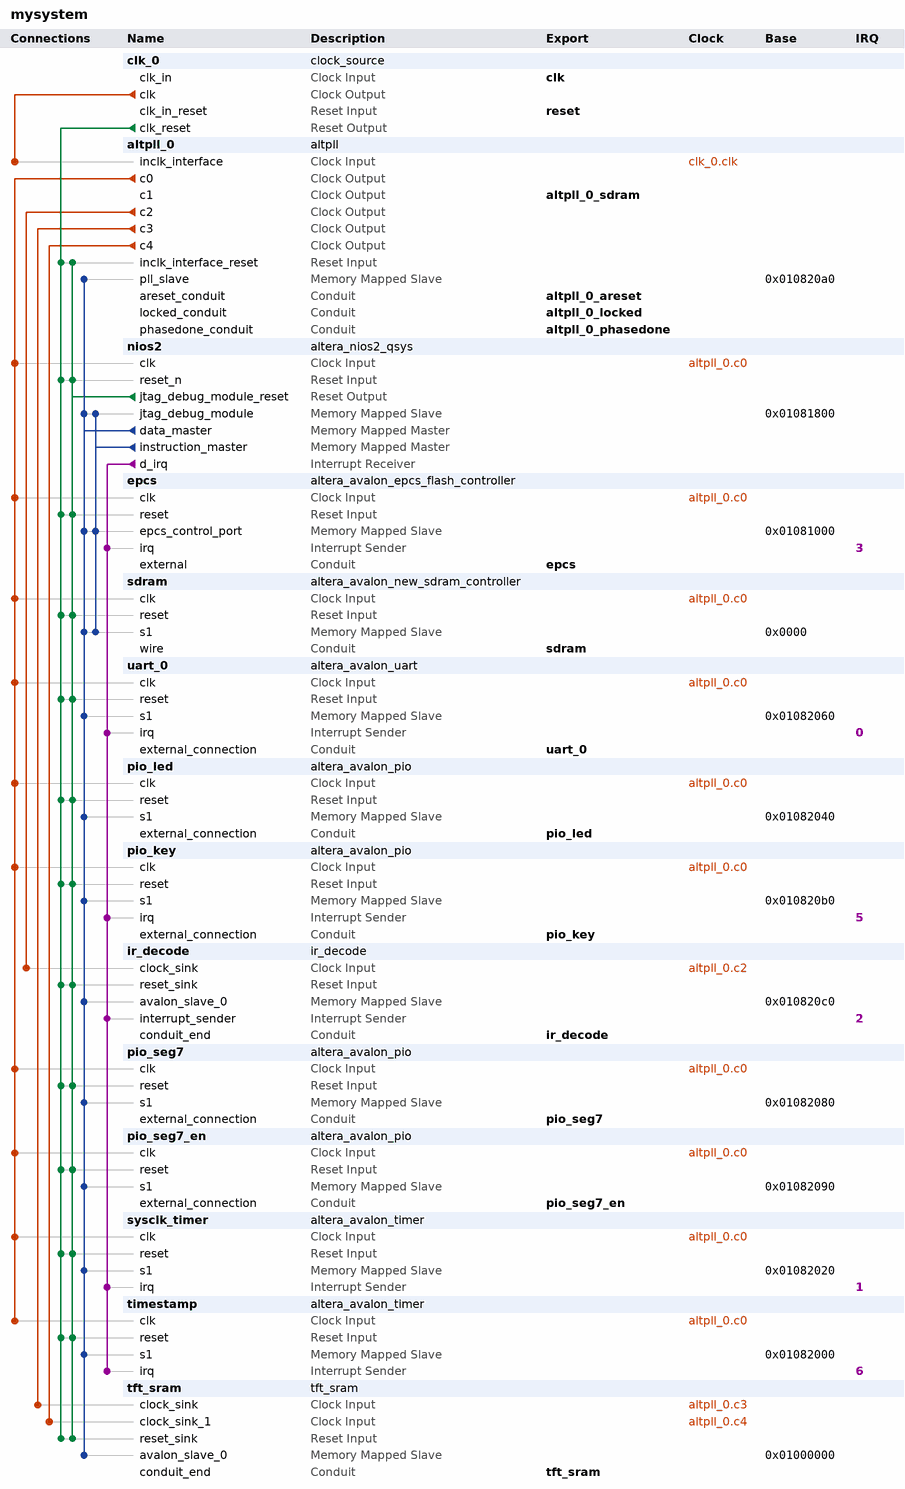
[diagram p0: system contents]
# Platform Designer (Qsys) system mysystem, Cyclone IV E EP4CE10F17C8
# Parameters at their usual value, and those the tool derives, are not listed.
package require -exact qsys 13.0.1
create_system mysystem
set_project_property DEVICE_FAMILY {Cyclone IV E}
set_project_property DEVICE EP4CE10F17C8

add_instance clk_0 clock_source 13.0
set_instance_parameter_value clk_0 clockFrequency 50000000

add_instance altpll_0 altpll 13.0
set_instance_parameter_value altpll_0 INCLK0_INPUT_FREQUENCY 20000
set_instance_parameter_value altpll_0 CLK0_MULTIPLY_BY 2
set_instance_parameter_value altpll_0 CLK1_MULTIPLY_BY 2
set_instance_parameter_value altpll_0 CLK2_MULTIPLY_BY 1
set_instance_parameter_value altpll_0 CLK3_MULTIPLY_BY 1
set_instance_parameter_value altpll_0 CLK4_MULTIPLY_BY 9
set_instance_parameter_value altpll_0 CLK0_DIVIDE_BY 1
set_instance_parameter_value altpll_0 CLK1_DIVIDE_BY 1
set_instance_parameter_value altpll_0 CLK2_DIVIDE_BY 1
set_instance_parameter_value altpll_0 CLK3_DIVIDE_BY 1
set_instance_parameter_value altpll_0 CLK4_DIVIDE_BY 50
set_instance_parameter_value altpll_0 CLK1_PHASE_SHIFT -2500
set_instance_parameter_value altpll_0 CLK2_PHASE_SHIFT 0
set_instance_parameter_value altpll_0 CLK3_PHASE_SHIFT 0
set_instance_parameter_value altpll_0 CLK4_PHASE_SHIFT 0
set_instance_parameter_value altpll_0 CLK1_DUTY_CYCLE 50
set_instance_parameter_value altpll_0 CLK2_DUTY_CYCLE 50
set_instance_parameter_value altpll_0 CLK3_DUTY_CYCLE 50
set_instance_parameter_value altpll_0 CLK4_DUTY_CYCLE 50
set_instance_parameter_value altpll_0 PORT_clk1 PORT_USED
set_instance_parameter_value altpll_0 PORT_clk2 PORT_USED
set_instance_parameter_value altpll_0 PORT_clk3 PORT_USED
set_instance_parameter_value altpll_0 PORT_clk4 PORT_USED
set_instance_parameter_value altpll_0 PORT_ARESET PORT_USED
set_instance_parameter_value altpll_0 PORT_LOCKED PORT_USED

add_instance nios2 altera_nios2_qsys 13.0
set_instance_parameter_value nios2 resetSlave epcs.epcs_control_port
set_instance_parameter_value nios2 mmu_TLBMissExcSlave None
set_instance_parameter_value nios2 exceptionSlave sdram.s1
set_instance_parameter_value nios2 breakSlave nios2.jtag_debug_module
set_instance_parameter_value nios2 impl Fast
set_instance_parameter_value nios2 icache_size 4096

add_instance epcs altera_avalon_epcs_flash_controller 13.0.1

add_instance sdram altera_avalon_new_sdram_controller 13.0.1
set_instance_parameter_value sdram TAC 5.5
set_instance_parameter_value sdram TRCD 20.0
set_instance_parameter_value sdram TRP 20.0
set_instance_parameter_value sdram casLatency 3
set_instance_parameter_value sdram columnWidth 9
set_instance_parameter_value sdram dataWidth 16
set_instance_parameter_value sdram generateSimulationModel false
set_instance_parameter_value sdram model single_Micron_MT48LC4M32B2_7_chip
set_instance_parameter_value sdram numberOfBanks 4
set_instance_parameter_value sdram numberOfChipSelects 1
set_instance_parameter_value sdram powerUpDelay 100.0
set_instance_parameter_value sdram refreshPeriod 15.625
set_instance_parameter_value sdram rowWidth 12

add_instance uart_0 altera_avalon_uart 13.0.1
set_instance_parameter_value uart_0 baud 9600
set_instance_parameter_value uart_0 dataBits 8
set_instance_parameter_value uart_0 fixedBaud false
set_instance_parameter_value uart_0 parity NONE
set_instance_parameter_value uart_0 stopBits 1

add_instance pio_led altera_avalon_pio 13.0.1
set_instance_parameter_value pio_led bitModifyingOutReg true
set_instance_parameter_value pio_led direction Output
set_instance_parameter_value pio_led resetValue 15
set_instance_parameter_value pio_led width 4

add_instance pio_key altera_avalon_pio 13.0.1
set_instance_parameter_value pio_key captureEdge true
set_instance_parameter_value pio_key direction Input
set_instance_parameter_value pio_key edgeType FALLING
set_instance_parameter_value pio_key generateIRQ true
set_instance_parameter_value pio_key irqType EDGE
set_instance_parameter_value pio_key width 2

add_instance ir_decode ir_decode 1.0

add_instance pio_seg7 altera_avalon_pio 13.0.1
set_instance_parameter_value pio_seg7 direction Output
set_instance_parameter_value pio_seg7 resetValue 4294967295
set_instance_parameter_value pio_seg7 width 32

add_instance pio_seg7_en altera_avalon_pio 13.0.1
set_instance_parameter_value pio_seg7_en direction Output
set_instance_parameter_value pio_seg7_en width 1

add_instance sysclk_timer altera_avalon_timer 13.0.1
set_instance_parameter_value sysclk_timer period 10
set_instance_parameter_value sysclk_timer periodUnits MSEC

add_instance timestamp altera_avalon_timer 13.0.1
set_instance_parameter_value timestamp period 10
set_instance_parameter_value timestamp periodUnits MSEC

add_instance tft_sram tft_sram 1.0

# connections
add_connection altpll_0.c0 epcs.clk clock
add_connection altpll_0.c0 nios2.clk clock
add_connection altpll_0.c0 pio_key.clk clock
add_connection altpll_0.c0 pio_led.clk clock
add_connection altpll_0.c0 pio_seg7.clk clock
add_connection altpll_0.c0 pio_seg7_en.clk clock
add_connection altpll_0.c0 sdram.clk clock
add_connection altpll_0.c0 sysclk_timer.clk clock
add_connection altpll_0.c0 timestamp.clk clock
add_connection altpll_0.c0 uart_0.clk clock
add_connection altpll_0.c2 ir_decode.clock_sink clock
add_connection altpll_0.c3 tft_sram.clock_sink clock
add_connection altpll_0.c4 tft_sram.clock_sink_1 clock
add_connection clk_0.clk altpll_0.inclk_interface clock
add_connection clk_0.clk_reset altpll_0.inclk_interface_reset reset
add_connection clk_0.clk_reset epcs.reset reset
add_connection clk_0.clk_reset ir_decode.reset_sink reset
add_connection clk_0.clk_reset nios2.reset_n reset
add_connection clk_0.clk_reset pio_key.reset reset
add_connection clk_0.clk_reset pio_led.reset reset
add_connection clk_0.clk_reset pio_seg7.reset reset
add_connection clk_0.clk_reset pio_seg7_en.reset reset
add_connection clk_0.clk_reset sdram.reset reset
add_connection clk_0.clk_reset sysclk_timer.reset reset
add_connection clk_0.clk_reset tft_sram.reset_sink reset
add_connection clk_0.clk_reset timestamp.reset reset
add_connection clk_0.clk_reset uart_0.reset reset
add_connection nios2.jtag_debug_module_reset altpll_0.inclk_interface_reset reset
add_connection nios2.jtag_debug_module_reset epcs.reset reset
add_connection nios2.jtag_debug_module_reset ir_decode.reset_sink reset
add_connection nios2.jtag_debug_module_reset nios2.reset_n reset
add_connection nios2.jtag_debug_module_reset pio_key.reset reset
add_connection nios2.jtag_debug_module_reset pio_led.reset reset
add_connection nios2.jtag_debug_module_reset pio_seg7.reset reset
add_connection nios2.jtag_debug_module_reset pio_seg7_en.reset reset
add_connection nios2.jtag_debug_module_reset sdram.reset reset
add_connection nios2.jtag_debug_module_reset sysclk_timer.reset reset
add_connection nios2.jtag_debug_module_reset tft_sram.reset_sink reset
add_connection nios2.jtag_debug_module_reset timestamp.reset reset
add_connection nios2.jtag_debug_module_reset uart_0.reset reset
add_connection nios2.data_master altpll_0.pll_slave avalon
set_connection_parameter_value nios2.data_master/altpll_0.pll_slave baseAddress 0x010820a0
add_connection nios2.data_master epcs.epcs_control_port avalon
set_connection_parameter_value nios2.data_master/epcs.epcs_control_port baseAddress 0x01081000
add_connection nios2.data_master ir_decode.avalon_slave_0 avalon
set_connection_parameter_value nios2.data_master/ir_decode.avalon_slave_0 baseAddress 0x010820c0
add_connection nios2.data_master nios2.jtag_debug_module avalon
set_connection_parameter_value nios2.data_master/nios2.jtag_debug_module baseAddress 0x01081800
add_connection nios2.data_master pio_key.s1 avalon
set_connection_parameter_value nios2.data_master/pio_key.s1 baseAddress 0x010820b0
add_connection nios2.data_master pio_led.s1 avalon
set_connection_parameter_value nios2.data_master/pio_led.s1 baseAddress 0x01082040
add_connection nios2.data_master pio_seg7.s1 avalon
set_connection_parameter_value nios2.data_master/pio_seg7.s1 baseAddress 0x01082080
add_connection nios2.data_master pio_seg7_en.s1 avalon
set_connection_parameter_value nios2.data_master/pio_seg7_en.s1 baseAddress 0x01082090
add_connection nios2.data_master sdram.s1 avalon
set_connection_parameter_value nios2.data_master/sdram.s1 baseAddress 0x0000
add_connection nios2.data_master sysclk_timer.s1 avalon
set_connection_parameter_value nios2.data_master/sysclk_timer.s1 baseAddress 0x01082020
add_connection nios2.data_master tft_sram.avalon_slave_0 avalon
set_connection_parameter_value nios2.data_master/tft_sram.avalon_slave_0 baseAddress 0x01000000
add_connection nios2.data_master timestamp.s1 avalon
set_connection_parameter_value nios2.data_master/timestamp.s1 baseAddress 0x01082000
add_connection nios2.data_master uart_0.s1 avalon
set_connection_parameter_value nios2.data_master/uart_0.s1 baseAddress 0x01082060
add_connection nios2.instruction_master epcs.epcs_control_port avalon
set_connection_parameter_value nios2.instruction_master/epcs.epcs_control_port baseAddress 0x01081000
add_connection nios2.instruction_master nios2.jtag_debug_module avalon
set_connection_parameter_value nios2.instruction_master/nios2.jtag_debug_module baseAddress 0x01081800
add_connection nios2.instruction_master sdram.s1 avalon
set_connection_parameter_value nios2.instruction_master/sdram.s1 baseAddress 0x0000
add_connection nios2.d_irq epcs.irq interrupt
set_connection_parameter_value nios2.d_irq/epcs.irq irqNumber 3
add_connection nios2.d_irq ir_decode.interrupt_sender interrupt
set_connection_parameter_value nios2.d_irq/ir_decode.interrupt_sender irqNumber 2
add_connection nios2.d_irq pio_key.irq interrupt
set_connection_parameter_value nios2.d_irq/pio_key.irq irqNumber 5
add_connection nios2.d_irq sysclk_timer.irq interrupt
set_connection_parameter_value nios2.d_irq/sysclk_timer.irq irqNumber 1
add_connection nios2.d_irq timestamp.irq interrupt
set_connection_parameter_value nios2.d_irq/timestamp.irq irqNumber 6
add_connection nios2.d_irq uart_0.irq interrupt
set_connection_parameter_value nios2.d_irq/uart_0.irq irqNumber 0

# exported interfaces
add_interface clk clock sink
set_interface_property clk EXPORT_OF clk_0.clk_in
add_interface reset reset sink
set_interface_property reset EXPORT_OF clk_0.clk_in_reset
add_interface sdram conduit end
set_interface_property sdram EXPORT_OF sdram.wire
add_interface uart_0 conduit end
set_interface_property uart_0 EXPORT_OF uart_0.external_connection
add_interface pio_led conduit end
set_interface_property pio_led EXPORT_OF pio_led.external_connection
add_interface pio_key conduit end
set_interface_property pio_key EXPORT_OF pio_key.external_connection
add_interface altpll_0_sdram clock source
set_interface_property altpll_0_sdram EXPORT_OF altpll_0.c1
add_interface ir_decode conduit end
set_interface_property ir_decode EXPORT_OF ir_decode.conduit_end
add_interface altpll_0_areset conduit end
set_interface_property altpll_0_areset EXPORT_OF altpll_0.areset_conduit
add_interface altpll_0_locked conduit end
set_interface_property altpll_0_locked EXPORT_OF altpll_0.locked_conduit
add_interface altpll_0_phasedone conduit end
set_interface_property altpll_0_phasedone EXPORT_OF altpll_0.phasedone_conduit
add_interface pio_seg7 conduit end
set_interface_property pio_seg7 EXPORT_OF pio_seg7.external_connection
add_interface pio_seg7_en conduit end
set_interface_property pio_seg7_en EXPORT_OF pio_seg7_en.external_connection
add_interface epcs conduit end
set_interface_property epcs EXPORT_OF epcs.external
add_interface tft_sram conduit end
set_interface_property tft_sram EXPORT_OF tft_sram.conduit_end

set_interconnect_requirement {$system} qsys_mm.clockCrossingAdapter HANDSHAKE
set_interconnect_requirement {$system} qsys_mm.maxAdditionalLatency 1

save_system mysystem.qsys
